# EAGLE design BMS_breakout_2 (EAGLE 9.5.1)
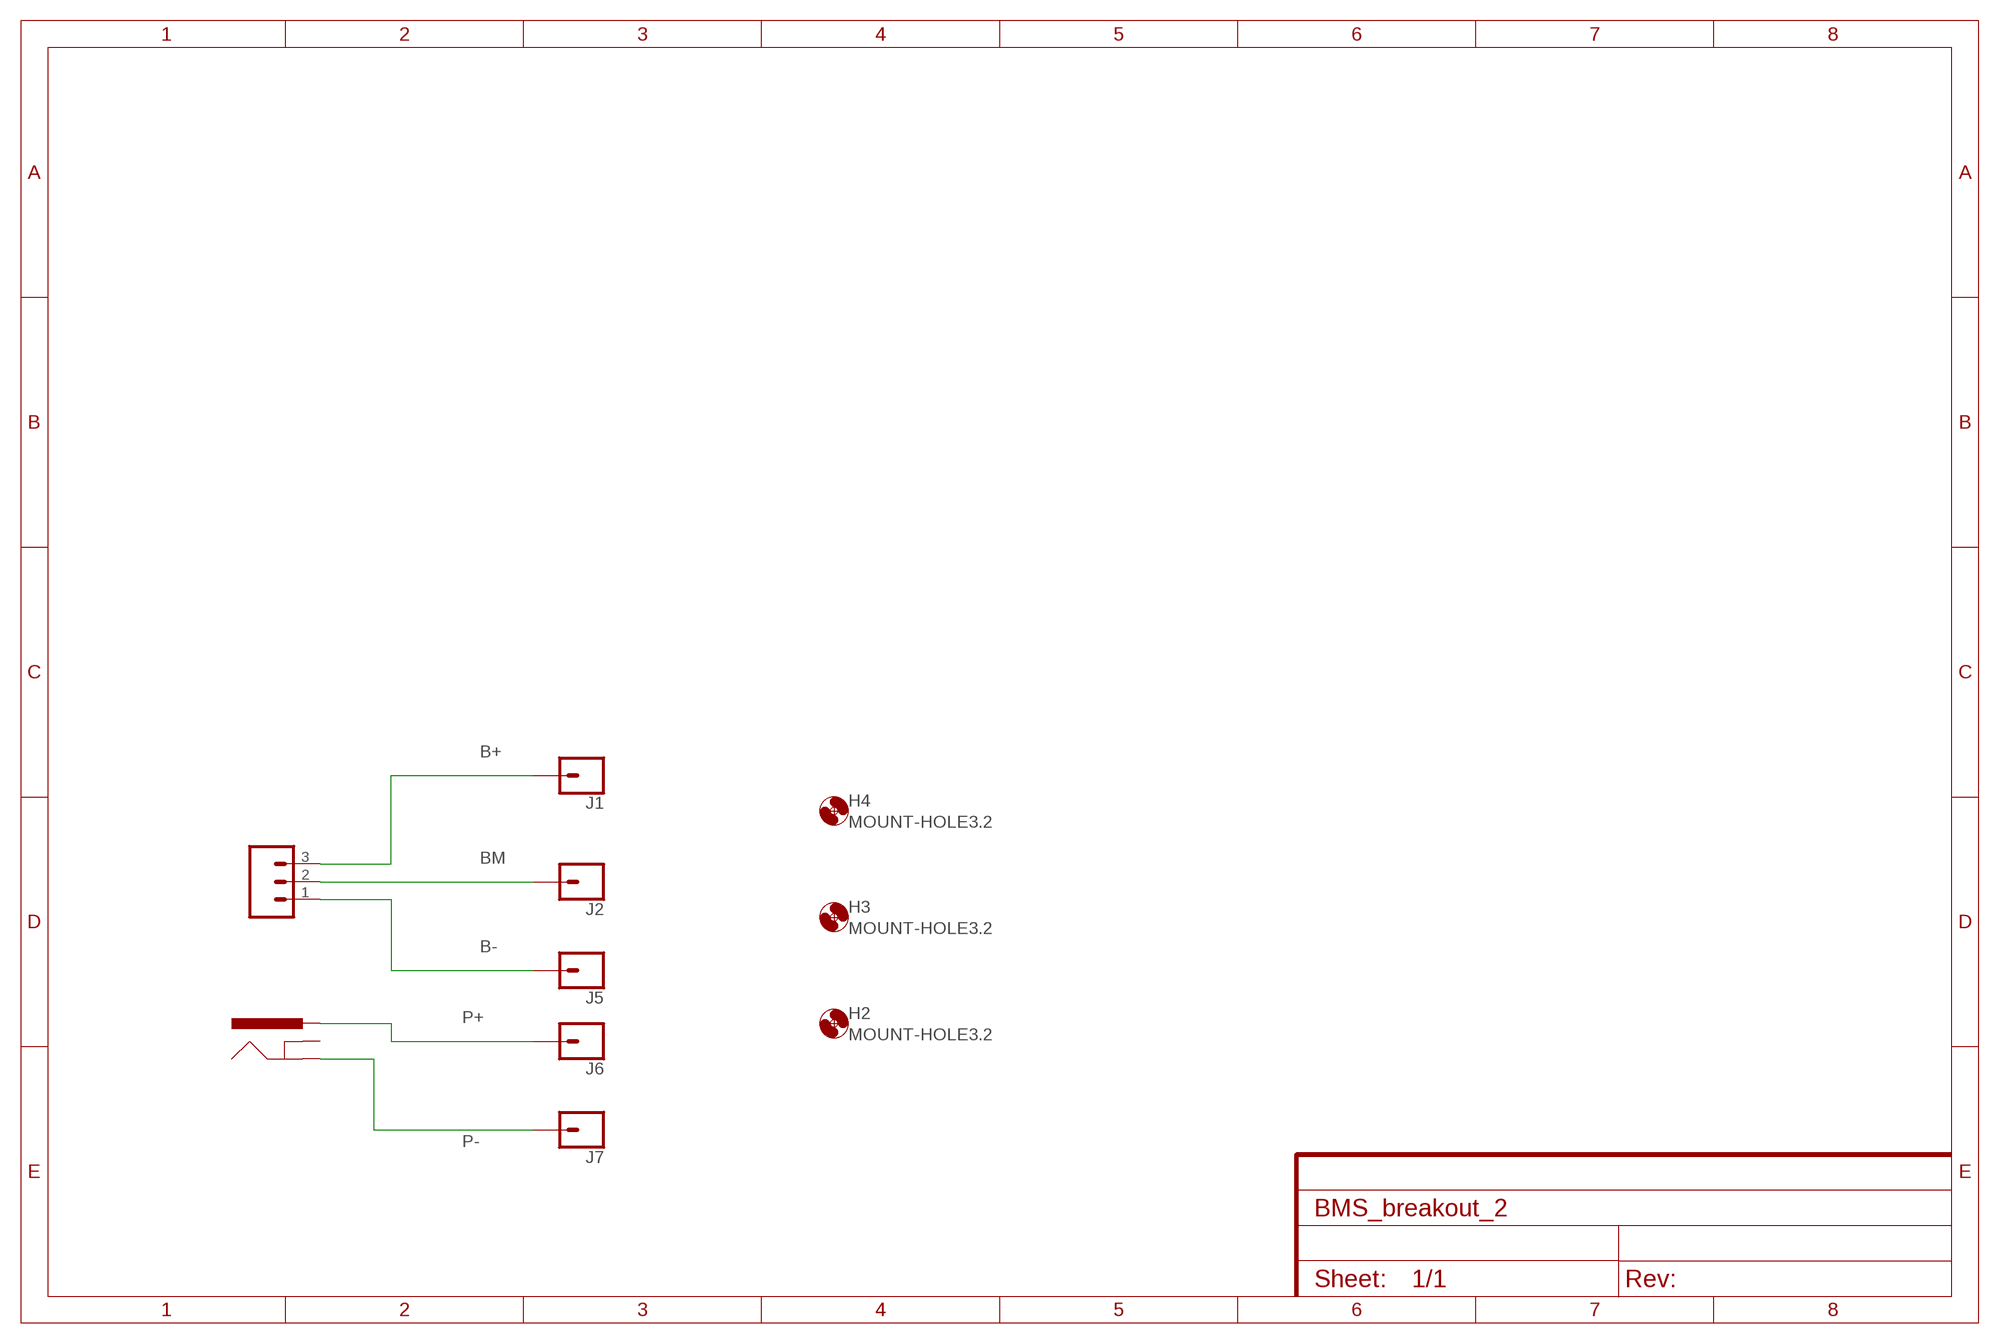
[diagram p0: schematic, sheet 1]

## Parts
H2  MOUNT-HOLE3.2  [3,2]
H3  MOUNT-HOLE3.2  [3,2]
H4  MOUNT-HOLE3.2  [3,2]
J1  CONN_01  [1X01]
J2  CONN_01  [1X01]
J3  CONN_03-SCREW-5MM  [SCREWTERMINAL-5MM-3]
J4  5.5x2.1mm Barrel  POWER_JACKSMD  [POWER_JACK_SMD]
J5  CONN_01  [1X01]
J6  CONN_01  [1X01]
J7  CONN_01  [1X01]

## Nets
B+: J1.1 J3.3
B-: J3.1 J5.1
BM: J2.1 J3.2
P+: J4.VIN0(PWR) J6.1
P-: J4.P$4(GND) J7.1
Unconnected: J4.GND(GNDBREAK)

## Library data of the parts
H2-H4 = holes:MOUNT-HOLE: MOUNTING HOLE with drill center marker
J1 J2 J5-J7 = SparkFun-Connectors:CONN_01: Single connection point. Often used as Generic Header-pin footprint for 0.1 inch spaced/style header connections On any of the 0.1 inch spaced packages, you can populate with these: Break Away Headers - Straight <https://www.sparkfun.com/products/116> (PRT-00116) Break Away Male Headers - Right Angle <https://www.sparkfun.com/products/553> (PRT-00553) Female Headers <https://www.sparkfun.com/products/115> (PRT-00115) Break Away Headers - Machine Pin <https://www.sparkfun.com/products/117> (PRT-00117) Break Away Female Headers - Swiss Machine Pin <https://www.sparkfun.com/products/743> (PRT-00743) This device is also useful as a general connection point to wire up your design to another part of your project. Our various solder wires solder well into these plated through hole pads. Hook-Up Wire - Assortment (Stranded, 22 AWG) <https://www.sparkfun.com/products/11375> (PRT-11375) Hook-Up Wire - Assortment (Solid Core, 22 AWG) <https://www.sparkfun.com/products/11367> (PRT-11367) View the entire wire category on our website here <https://www.sparkfun.com/categories/141> Special notes: SMTSO-256-ET is a "flush mount" nut for a 4-40 screw. We mostly use this on specialty testbeds; it is a nice way to connect hardware to your PCB at an adjustable hieght. Also note, the SNAP packages are for using a snappable style connector. We sell a baggie of snaps and they are also used on two LilyPad designs: Snap Assortment - 30 pack (male and female) <https://www.sparkfun.com/products/11347> (DEV-11347) LilyPad Arduino SimpleSnap <https://www.sparkfun.com/products/10941> (DEV-10941) LilyPad SimpleSnap Protoboard <https://www.sparkfun.com/products/10940> (DEV-10940)
J3 = SparkFun-Connectors:CONN_03: Multi connection point. Often used as Generic Header-pin footprint for 0.1 inch spaced/style header connections On any of the 0.1 inch spaced packages, you can populate with these: Break Away Headers - Straight <https://www.sparkfun.com/products/116> (PRT-00116) Break Away Male Headers - Right Angle <https://www.sparkfun.com/products/553> (PRT-00553) Female Headers <https://www.sparkfun.com/products/115> (PRT-00115) Break Away Headers - Machine Pin <https://www.sparkfun.com/products/117> (PRT-00117) Break Away Female Headers - Swiss Machine Pin <https://www.sparkfun.com/products/743> (PRT-00743) Stackable Header - 3 Pin (Female, 0.1") <https://www.sparkfun.com/products/13875> (PRT-13875) For SCREWTERMINALS and SPRING TERMINALS visit here: Screw Terimnals on SparkFun.com <https://www.sparkfun.com/search/results?term=Screw+Terminals> (5mm/3.5mm/2.54mm spacing) This device is also useful as a general connection point to wire up your design to another part of your project. Our various solder wires solder well into these plated through hole pads. Hook-Up Wire - Assortment (Stranded, 22 AWG) <https://www.sparkfun.com/products/11375> (PRT-11375) Hook-Up Wire - Assortment (Solid Core, 22 AWG) <https://www.sparkfun.com/products/11367> (PRT-11367) View the entire wire category on our website here <https://www.sparkfun.com/categories/141> Special notes: Molex polarized connector foot print use with SKU : PRT-08232 with associated crimp pins and housings.; PROD_ID: CONN-10134; SF_SKU: PRT-08433
J4 = SparkFun-Connectors:POWER_JACK: Power Jack Connector This is the standard 5.5mm barrel jack for power. The PTH is the most common, proven, reliable, footprint. The Slot footprint only works if the mill layer is transmitted to the PCB fab house so be warned. Here are the connectors we sell at SparkFun: DC Barrel Power Jack/Connector <https://www.sparkfun.com/products/119> (PRT-00119) DC Barrel Power Jack/Connector (SMD) <https://www.sparkfun.com/products/12748> (PRT-12748) DC Barrel Jack Adapter - Breadboard Compatible <https://www.sparkfun.com/products/10811> (PRT-10811) It is used on this SparkFun product (and many, many others): SparkFun RedBoard - Programmed with Arduino <https://www.sparkfun.com/products/12757> (DEV-12757) Also, if you need a mating power supply or connector, please check these out: Wall Adapter Power Supply - 9VDC 650mA <https://www.sparkfun.com/products/298> (TOL-00298) DC Barrel Jack Adapter - Male <https://www.sparkfun.com/products/10287> (PRT-10287); PROD_ID: CONN-08106; SF_ID: PRT-12748

## Board
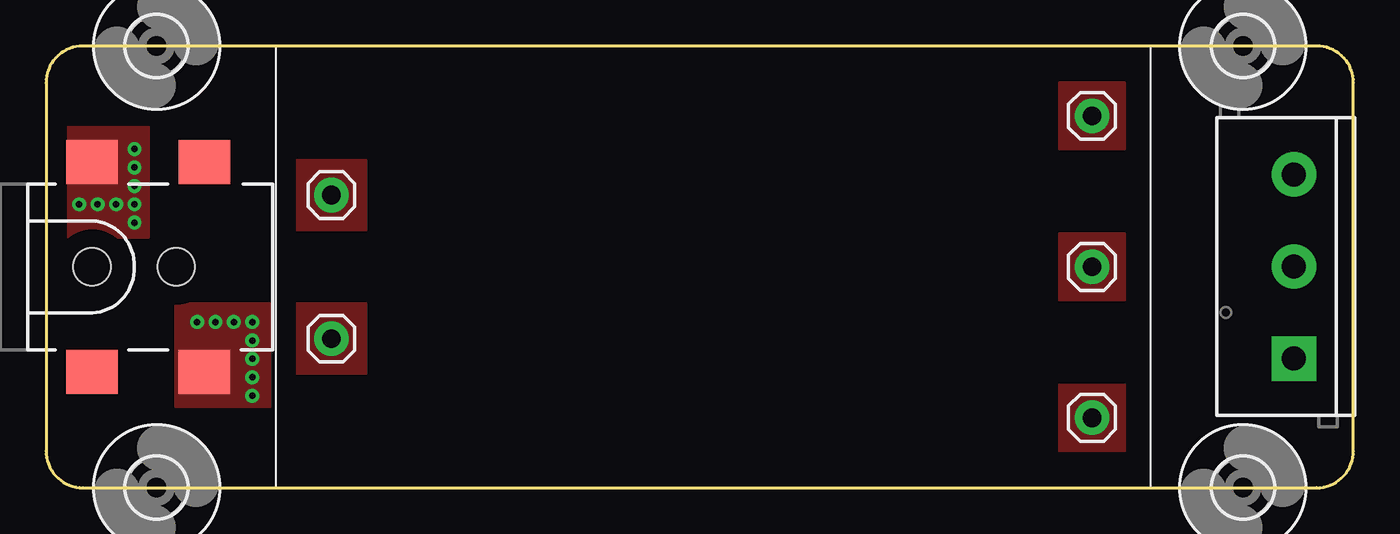
[diagram p1: board, top side]
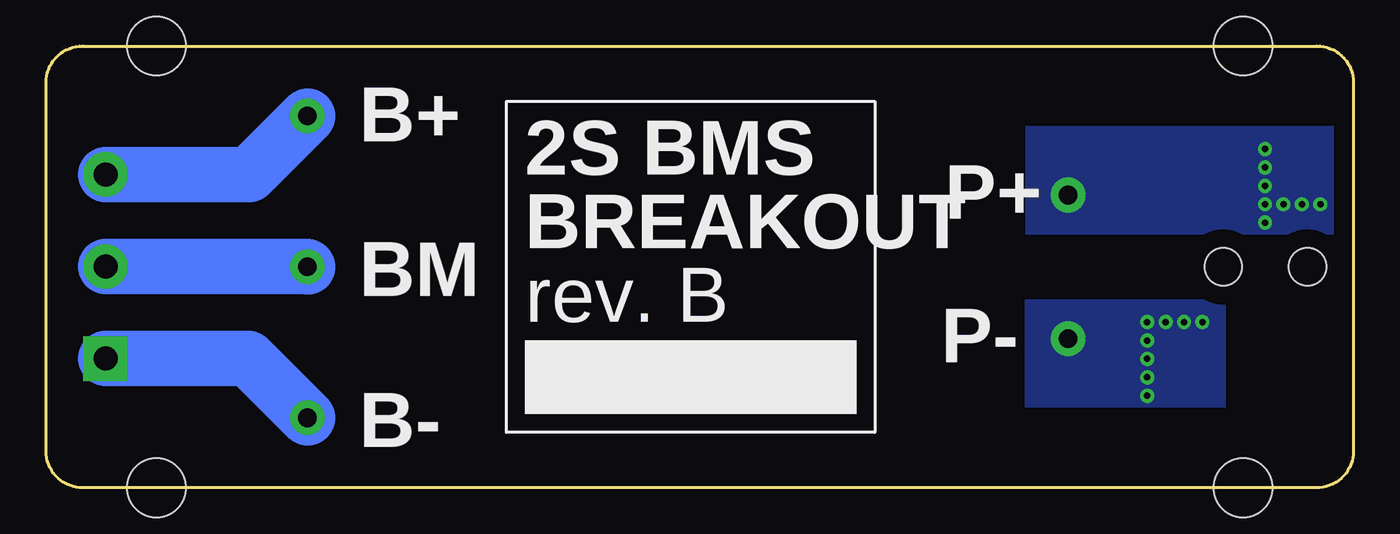
[diagram p2: board, bottom side, seen from below]

Size 71 x 24 mm. Coordinates in mm from the lower left corner, seen from the top.
Outline: 2,0 69,0 arc90 71,2 71,22 arc90 69,24 2,24 arc90 0,22 0,2 arc90 2,0
Copper layers (1*16): Top 0.035mm / dielectric 1.5mm / Bottom 0.035mm
Design rules "default": minimum track width 6mil, minimum drill 0.35mm, track to track 6mil, track to pad 6mil, pad to pad 6mil, via to via 6mil, smd to smd 6mil, copper to edge 40mil, drill to drill 6mil, minimum pad ring 10mil, minimum via ring 8mil, stop-mask expansion 4mil, vias tented up to drill 0mil, thermal gap 10mil

### Footprints (pad centres in the part's own frame; a part is rotated, then mirrored left to right if it is on the bottom)
3,2 = hole 3.2: 0,0
1X01 = drill 1.016 pad 1.88: 1 0,0
SCREWTERMINAL-5MM-3 = drill 1.3 pad 2.413 square: 1 0,0 | drill 1.3 pad 2.413: 2 5,0; 3 10,0
POWER_JACK_SMD = smd 2.8 x 2.4: GND 0,-5.7; P$4 6.1,-5.7; VIN0 0,5.7; VIN1 6.1,5.7 | hole 2.032: 0,0; 4.572,0

### Placement (x,y rotation side)
H1  MOUNT-HOLE3.2  [3,2]  65,24 0 top
H2  6,24 0 top
H3  6,0 0 top
H4  65,0 0 top
J1  56.8,20.2 0 top
J2  56.8,12 0 top
J3  67.77,7.02 90 top
J4  2.5,12 0 top
J5  56.8,3.8 0 top
J6  15.5,15.9 0 top
J7  15.5,8.1 0 top

### Tracks (layer width: path | path; a pad name or v marks a point on that pad's centre or on a via)
B+
  Bottom 3: J3.3 59.98,17.02 J1.1
  pour Top (no thermals): 58.6,22 55,22 55,18.4 58.6,18.4
B-
  Bottom 3: J3.1 60.02,7.02 J5.1
  pour Top (no thermals): 58.6,5.6 55,5.6 55,2 58.6,2
BM
  Bottom 3: J3.2 56.82,12.02 J2.1
  pour Top (no thermals): 55,13.8 55,10.2 58.6,10.2 58.6,13.8
P+  (via drill 0.35)
  other vias: 1.8,15.4 2.8,15.4 3.8,15.4 4.8,15.4 4.8,16.4 4.8,17.4 4.8,18.4 4.8,14.4
  pour Top (no thermals): 13.6,17.8 13.6,14 17.4,14 17.4,17.8
  pour Bottom (no thermals): 17.8,13.8 0.6,13.8 0.6,19.6 17.8,19.6
  pour Top (no thermals): 1,19.6 1,13.6 5.6,13.6 5.6,19.6
P-  (via drill 0.35)
  other vias: 11.2,5 11.2,6 11.2,7 11.2,8 11.2,9 10.2,9 9.2,9 8.2,9
  pour Top (no thermals): 13.6,10 13.6,6.2 17.4,6.2 17.4,10
  pour Top (no thermals): 7,10 7,4.4 12.2,4.4 12.2,10
  pour Bottom (no thermals): 17.8,10.2 7,10.2 7,4.4 17.8,4.4

### Text on the board
bPlace: B+ | 2S BMS | P+ | BREAKOUT | BM | rev. B | P- | B-